# Altium project SkyWindow.PrjPcb
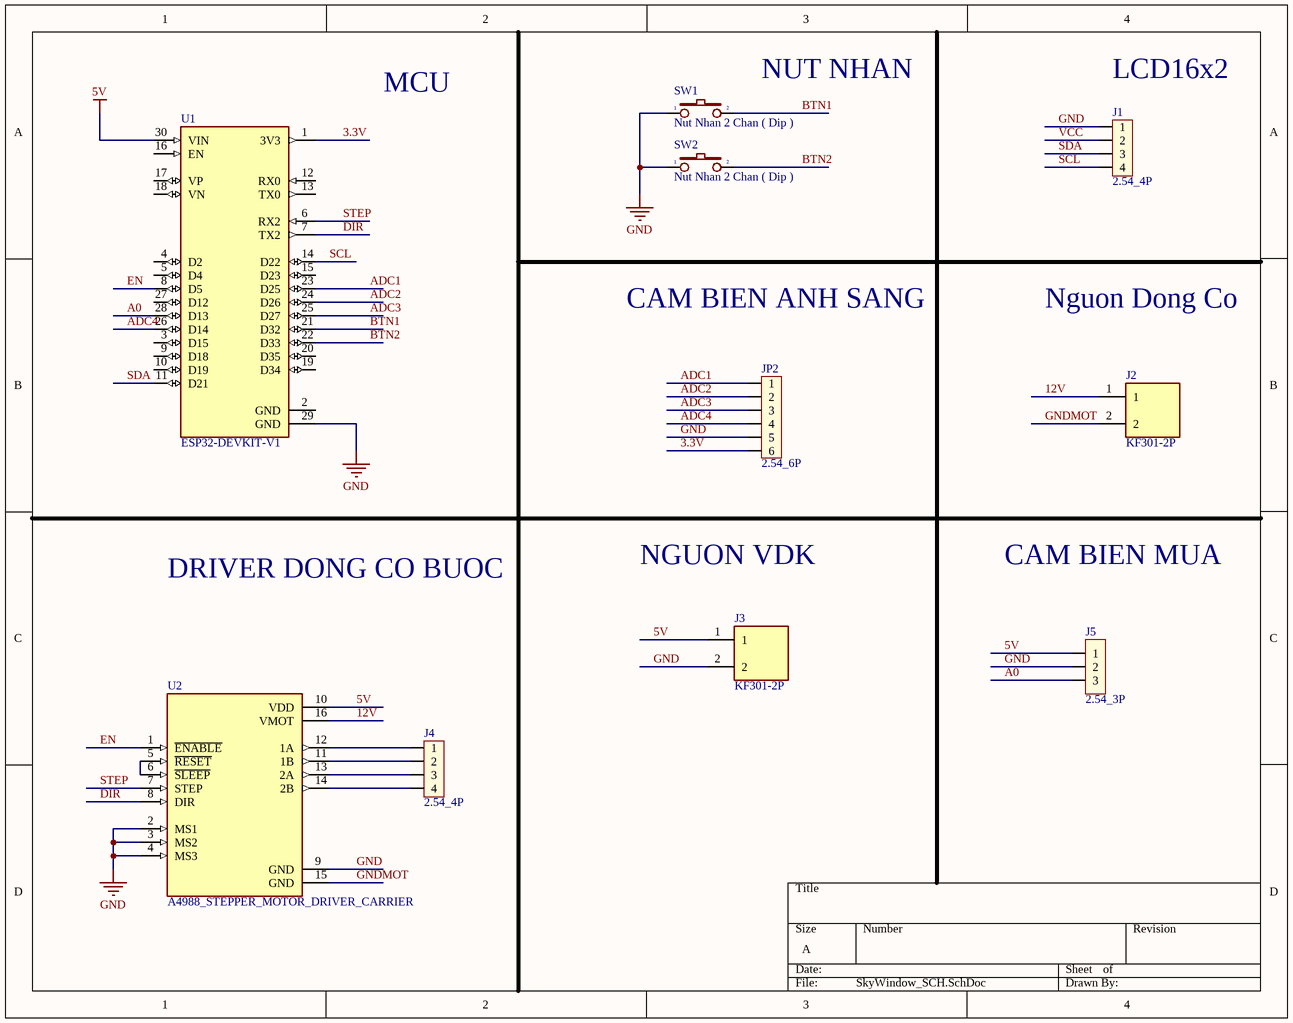
[diagram p0: SkyWindow_SCH.SchDoc]
1 sheet, 10 parts. Net scope: global (net labels, ports and power ports of the same name join across sheets).
Board file: SkyWindow_PCB.PcbDoc

## Sheet SkyWindow_SCH.SchDoc
size A

### Parts
J1  2.54_4P  [JP4]
J2  KF301-2P  [HANDSON_KF301-2P]
J3  KF301-2P  [HANDSON_KF301-2P]
J4  2.54_4P  [JP4]
J5  2.54_3P  [JP3]
JP2  2.54_6P  [JP6]
SW1  Nut Nhan 2 Chan ( Dip )  [SW2]
SW2  Nut Nhan 2 Chan ( Dip )  [SW2]
U1  ESP32-DEVKIT-V1  [MODULE_ESP32_DEVKIT_V1]
U2  A4988_STEPPER_MOTOR_DRIVER_CARRIER  [MODULE_A4988_STEPPER_MOTOR_DRIVER_CARRIER]

### Nets
5V: J3.1 J5.1 U1.30(VIN) U2.10(VDD)
GND: J1.1 J3.2 J5.2 JP2.5 SW1.1 SW2.1 U1.29(GND) U2.2(MS1) U2.3(MS2) U2.4(MS3) U2.9(GND)
3.3V: JP2.6 U1.1(3V3)
12V: J2.1 U2.16(VMOT)
A0: J5.3 U1.28(D13)
ADC1: JP2.1 U1.23(D25)
ADC2: JP2.2 U1.24(D26)
ADC3: JP2.3 U1.25(D27)
ADC4: JP2.4 U1.26(D14)
BTN1: SW1.2 U1.21(D32)
BTN2: SW2.2 U1.22(D33)
DIR: U1.7(TX2) U2.8(DIR)
EN: U1.8(D5) U2.1(~{ENABLE})
GNDMOT: J2.2 U2.15(GND)
SCL: J1.4 U1.14(D22)
SDA: J1.3 U1.11(D21)
STEP: U1.6(RX2) U2.7(STEP)
VCC: J1.2
NetJ4_1: J4.1 U2.12(1A)
NetJ4_2: J4.2 U2.11(1B)
NetJ4_3: J4.3 U2.13(2A)
NetJ4_4: J4.4 U2.14(2B)
NetU2_5: U2.5(~{RESET}) U2.6(~{SLEEP})

Not connected (* = marked no-connect by the designer): U1 2(GND) 3(D15) 4(D2) 5(D4) 9(D18) 10(D19) 12(RX0) 13(TX0) 15(D23) 16(EN) 17(VP) 18(VN) 19(D34) 20(D35) 27(D12)

### Notes on the sheet
- MCU
- (near SW1) NUT NHAN
- (near J1) LCD16x2
- CAM BIEN ANH SANG
- Nguon Dong Co
- NGUON VDK
- CAM BIEN MUA
- DRIVER DONG CO BUOC

### Library data of the parts
J1 J4 = Jum Don Duc 2.54_4P: Cắm; Don_Vi: Con; Ma_Hang: MH000903; Value: Jump Đơn Đực 2.54MM 1x40P Thẳng 11MM; Ghi Chu: *; Kieu Chan: *; Chung_Loai: Cắm
J2 J3 = KF301-2P: 2 Pin Terminal Block 5mm Pitch; Price: None; Value: *; MP: KF301-2P; Package: None; Availability: Unavailable
J5 = Jum Don Duc 2.54_3P: Cắm; Ten_Linh_Kien: Jump Đơn Đực 2.54MM 1x40P Thẳng 11MM; Ma_Hang: MH000903; Don_Vi: Con; Kieu_Chan: *; Ghi_Chu: *; Chung_Loai: Cắm
JP2 = Jum Don Duc 2.54_6P: Cắm; Ten_Linh_Kien: Jump Đơn Đực 2.54MM 1x40P Thẳng 11MM; Ma_Hang: MH000903; Don_Vi: Con; Kieu_Chan: *; Ghi_Chu: *; Chung_Loai: Cắm
SW1 SW2 = Nut Nhan 2 Chan ( Dip ): Cắm; Ten_Linh_Kien: Nút Nhấn 2 Chân 6x6x5MM DIP; Ma_Hang: MH001959; Don_Vi: Con; Kieu_Chan: *; Ghi_Chu: *; Chung_Loai: Cắm
U1 = ESP32-DEVKIT-V1: Dual core, Wi-Fi: 2.4 GHz up to 150 Mbits/s,BLE (Bluetooth Low Energy) and legacy Bluetooth, 32 bits, Up to 240 MHz; MF: Do it; Price: None; Availability: Not in stock; Package: None; MP: ESP32-DEVKIT-V1; Value: *; SnapEDA_Link: https://www.snapeda.com/parts/ESP32-DEVKIT-V1/Do+it/view-part/?ref=snap; Check_prices: https://www.snapeda.com/parts/ESP32-DEVKIT-V1/Do+it/view-part/?ref=eda
U2 = A4988_STEPPER_MOTOR_DRIVER_CARRIER: Stepper motor controler; IC: A4988; 1A; Uin mot: 8Ã·35V; Price: None; Value: *; MP: A4988_STEPPER_MOTOR_DRIVER_CARRIER; Package: None; Availability: Unavailable